# EAGLE design MIDImike (EAGLE 9.6.2)
REV: 0.1
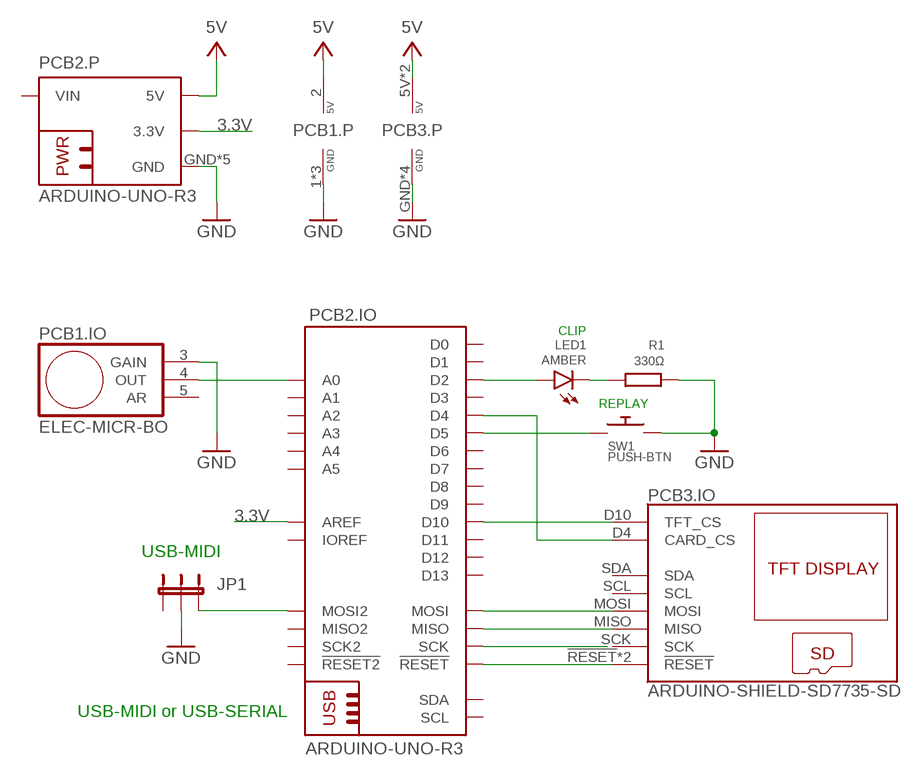
[diagram p0: schematic, sheet 1]

## Parts
JP1  JP2E  [JP2]
LED1  AMBER  LEDCHIPLED_0805  [CHIPLED_0805]
PCB1  ELEC-MICR-BO  [ELEC_MICR_BREAKOUT]
PCB2  ARDUINO-UNO-R3  [ARDUINO-UNO--R3]
PCB3  ARDUINO-SHIELD-SD7735-SD  [ARDIONO-SHIELD]
R1  330Ω  R-EU_R0805  [R0805]
SW1  PUSH-BTN  [TE_1-1825910-4]

## Nets
3.3V: PCB2.3.3V(.P:3.3V) PCB2.AREF(.IO:AREF)
5V: PCB1.2(.P:5V) PCB2.5V(.P:5V) PCB2.5V@1(.P:5V) PCB2.5V@2(.P:5V) PCB3.5V(.P:5V) PCB3.5V@1(.P:5V)
A0: PCB1.4(.IO:OUT) PCB2.A0(.IO:A0)
GND: JP1.2 PCB1.1(.P:GND) PCB1.3(.IO:GAIN) PCB1.P$1(.P:GND) PCB1.P$2(.P:GND) PCB2.GND(.P:GND) PCB2.GND@1(.P:GND) PCB2.GND@2(.P:GND) PCB2.GND@3(.P:GND) PCB2.GND@4(.P:GND) PCB3.GND(.P:GND) PCB3.GND@1(.P:GND) PCB3.GND@2(.P:GND) PCB3.GND@3(.P:GND) R1.1 SW1.2 SW1.2@1
N$1: LED1.A PCB2.D2(.IO:D2)
N$2: PCB2.MOSI(.IO:MOSI) PCB3.MOSI(.IO:MOSI)
N$3: JP1.3 PCB2.MOSI2(.IO:MOSI2)
N$4: PCB2.D10(.IO:D10) PCB3.D10(.IO:TFT_CS)
N$5: PCB2.MISO(.IO:MISO) PCB3.MISO(.IO:MISO)
N$6: PCB2.SCK(.IO:SCK)
N$7: PCB2.!RESET!(.IO:!RESET!) PCB2.!RESET!@1(.IO:!RESET!) PCB3.!RESET!(.IO:!RESET!) PCB3.!RESET!@1(.IO:!RESET!)
N$8: LED1.C R1.2
N$9: PCB2.D4(.IO:D4) PCB3.D4(.IO:CARD_CS)
REPLAY: PCB2.D5(.IO:D5) SW1.1 SW1.1@1
Unconnected: JP1.1 PCB1.5(.IO:AR) PCB2.!RESET2!(.IO:!RESET2!) PCB2.A1(.IO:A1) PCB2.A2(.IO:A2) PCB2.A3(.IO:A3) PCB2.A4(.IO:A4) PCB2.A5(.IO:A5) PCB2.D0(.IO:D0) PCB2.D1(.IO:D1) PCB2.D3(.IO:D3) PCB2.D6(.IO:D6) PCB2.D7(.IO:D7) PCB2.D8(.IO:D8) PCB2.D9(.IO:D9) PCB2.D11(.IO:D11) PCB2.D12(.IO:D12) PCB2.D13(.IO:D13) PCB2.IOREF(.IO:IOREF) PCB2.MISO2(.IO:MISO2) PCB2.SCK2(.IO:SCK2) PCB2.SCL(.IO:SCL) PCB2.SDA(.IO:SDA) PCB2.VIN(.P:VIN) PCB3.SCK(.IO:SCK) PCB3.SCL(.IO:SCL) PCB3.SDA(.IO:SDA)

## Notes on the sheet
- CLIP
- REPLAY
- USB-MIDI
- USB-MIDI or USB-SERIAL

## Library data of the parts
JP1 = Coert-Vonk:JP2E: JUMPER
LED1 = OPNpool:LED: LED OSRAM: - CHIPLED LG R971, LG N971, LY N971, LG Q971, LY Q971, LO R971, LY R971 LH N974, LH R974 LS Q976, LO Q976, LY Q976 LO Q996 - Hyper CHIPLED LW Q18S LB Q993, LB Q99A, LB R99A - SideLED LS A670, LO A670, LY A670, LG A670, LP A670 LB A673, LV A673, LT A673, LW A673 LH A674 LY A675 LS A676, LA A676, LO A676, LY A676, LW A676 LS A679, LY A679, LG A679 - Hyper Micro SIDELED® LS Y876, LA Y876, LO Y876, LY Y876 LT Y87S - SmartLED LW L88C, LW L88S LB L89C, LB L89S, LG L890 LS L89K, LO L89K, LY L89K LS L896, LA L896, LO L896, LY L896 - TOPLED LS T670, LO T670, LY T670, LG T670, LP T670 LSG T670, LSP T670, LSY T670, LOP T670, LYG T670 LG T671, LOG T671, LSG T671 LB T673, LV T673, LT T673, LW T673 LH T674 LS T676, LA T676, LO T676, LY T676, LB T676, LH T676, LSB T676, LW T676 LB T67C, LV T67C, LT T67C, LS T67K, LO T67K, LY T67K, LW E67C LS E67B, LA E67B, LO E67B, LY E67B, LB E67C, LV E67C, LT E67C LW T67C LS T679, LY T679, LG T679 LS T770, LO T770, LY T770, LG T770, LP T770 LB T773, LV T773, LT T773, LW T773 LH T774 LS E675, LA E675, LY E675, LS T675 LS T776, LA T776, LO T776, LY T776, LB T776 LHGB T686 LT T68C, LB T68C - Hyper Mini TOPLED® LB M676 - Mini TOPLED Santana® LG M470 LS M47K, LO M47K, LY M47K Source: http://www.osram.convergy.de LUXEON: - LUMILED® LXK2-PW12-R00, LXK2-PW12-S00, LXK2-PW14-U00, LXK2-PW14-V00 LXK2-PM12-R00, LXK2-PM12-S00, LXK2-PM14-U00 LXK2-PE12-Q00, LXK2-PE12-R00, LXK2-PE12-S00, LXK2-PE14-T00, LXK2-PE14-U00 LXK2-PB12-K00, LXK2-PB12-L00, LXK2-PB12-M00, LXK2-PB14-N00, LXK2-PB14-P00, LXK2-PB14-Q00 LXK2-PR12-L00, LXK2-PR12-M00, LXK2-PR14-Q00, LXK2-PR14-R00 LXK2-PD12-Q00, LXK2-PD12-R00, LXK2-PD12-S00 LXK2-PH12-R00, LXK2-PH12-S00 LXK2-PL12-P00, LXK2-PL12-Q00, LXK2-PL12-R00 Source: www.luxeon.com KINGBRIGHT: KA-3528ASYC Source: www.kingbright.com
PCB1 = Coert-Vonk:ELEC-MICR-BO: Footprint of Adafruit AGC Electret Microphone Amplifier - MAX9814 Link to part <https://learn.adafruit.com/adafruit-agc-electret-microphone-amplifier-max9814/overview>
PCB2 = Coert-Vonk:ARDUINO-UNO-R3: Footprint of Arduino R3 with two SPI headers Arduino Uno R3 Compatible Footprint. Matches PCB size of the original board.
PCB3 = Coert-Vonk:ARDUINO-SHIELD-SD7735-SD: Footprint of 1.8" Color TFT LCD display with MicroSD Card Shield - ST7735Rr Link to part <https://learn.adafruit.com/1-8-tft-display/1-8-tft-shield>
R1 = rcl:R-EU_: RESISTOR, European symbol; MANF: Bourns; MANF#: CRM0805-JW-1R5ELF; MOUSER#: 652-CRM0805JW1R5ELF; SPICEPREFIX: R
SW1 = Coert-Vonk:PUSH-BTN: Switch Tactile OFF (ON) SPST Round Button PC Pins 0.05A 24VDC 100000Cycles 1.56N Thru-Hole Loose; COMMENT: 1-1825910-4; DESCRIPTION: Switch Tactile OFF (ON) SPST Round Button PC Pins 0.05A 24VDC 100000Cycles 1.56N Thru-Hole; DIGI-KEY_PART_NUMBER: 450-1653-ND; MF: TE Connectivity; MP: 1-1825910-4; PACKAGE: None; PURCHASE-URL: https://pricing.snapeda.com/search/part/1-1825910-4/?ref=eda

## Board
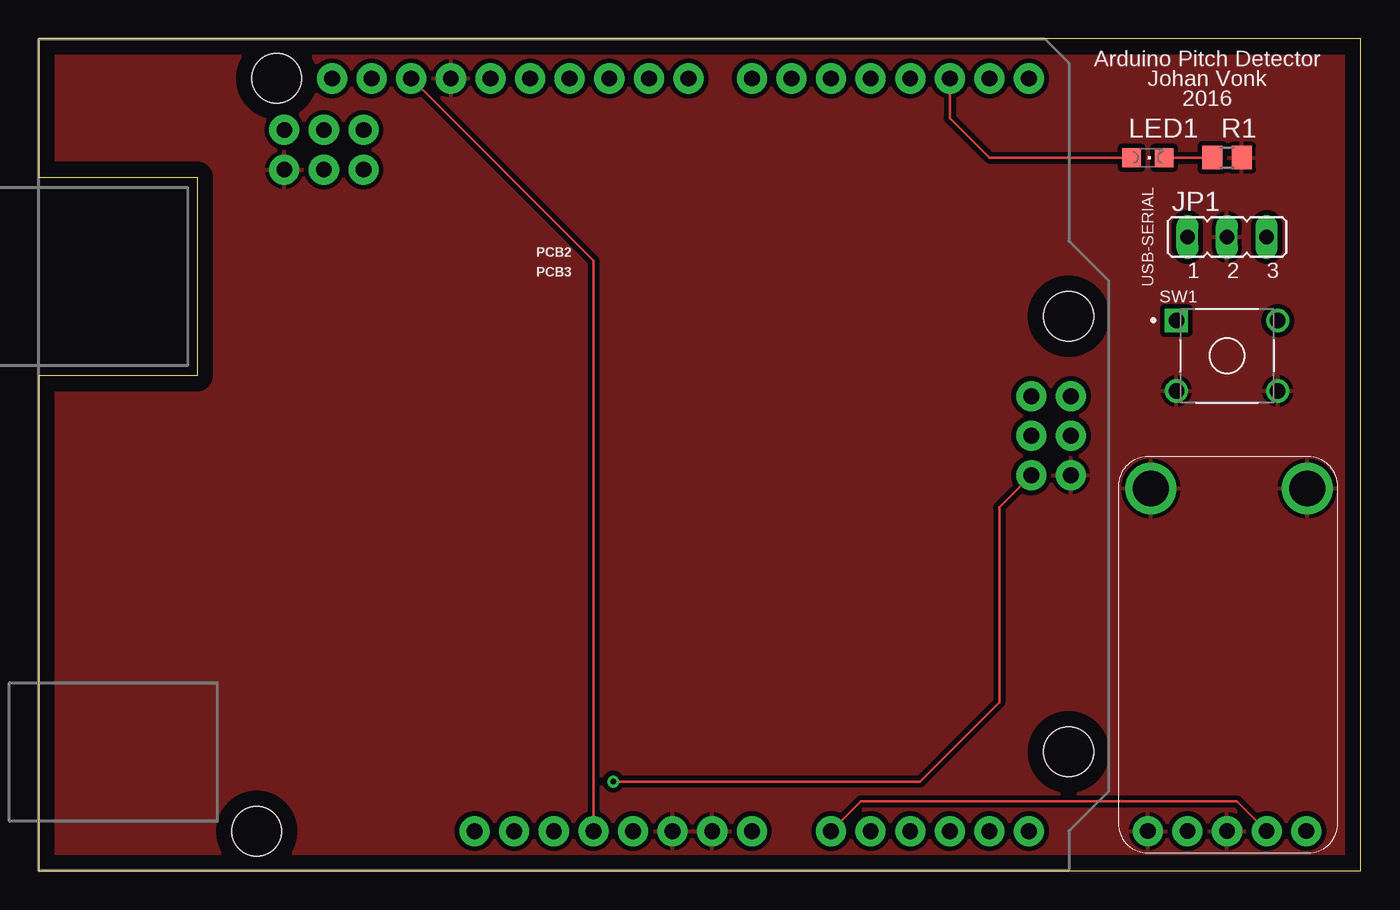
[diagram p1: board, top side]
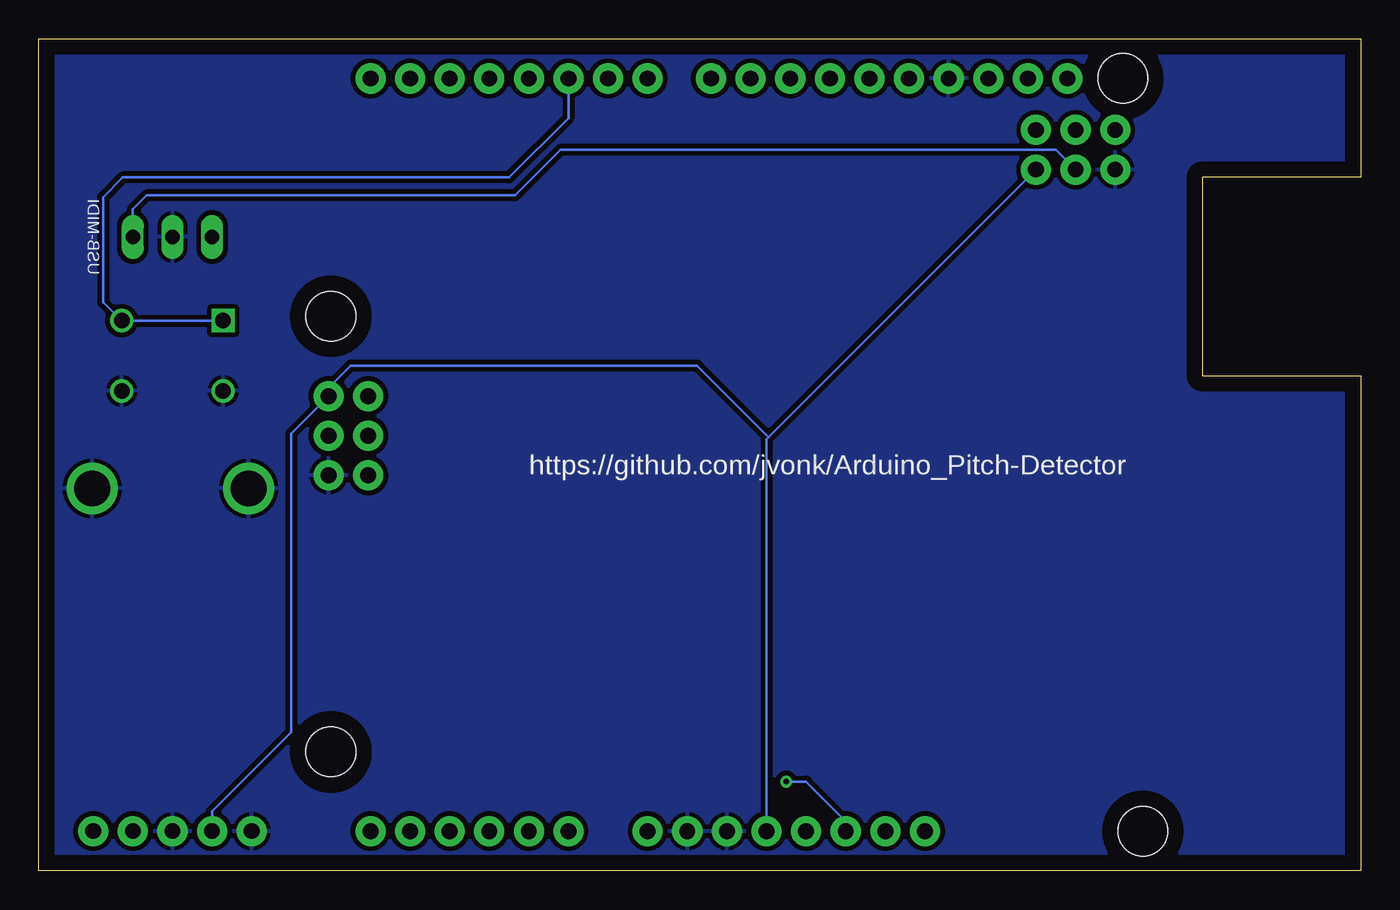
[diagram p2: board, bottom side, seen from below]

Size 84.76 x 53.33 mm. Coordinates in mm from the lower left corner, seen from the top.
Outline: 0,0 84.76,0 84.76,53.33 0,53.33 0,44.45 10.16,44.45 10.16,31.75 0,31.75 0,0
Copper layers (1*16): Top 0.035mm / dielectric 1.5mm / Bottom 0.035mm
Design rules "default": minimum track width 6mil, minimum drill 0.35mm, track to track 6mil, track to pad 6mil, pad to pad 6mil, via to via 6mil, smd to smd 6mil, copper to edge 40mil, drill to drill 6mil, minimum pad ring 10mil, minimum via ring 8mil, stop-mask expansion 4mil, vias tented up to drill 0mil, thermal gap 10mil

### Footprints (pad centres in the part's own frame; a part is rotated, then mirrored left to right if it is on the bottom)
JP2 = drill 0.914 long: 1 -2.54,0; 2 0,0; 3 2.54,0
CHIPLED_0805 = smd 1.2 x 1.2: A 0,-1.05; C 0,1.05
ELEC_MICR_BREAKOUT = drill 1 pad 1.93: 1 -11.303,5.715; 2 -11.303,3.175; 3 -11.303,0.635; 4 -11.303,-1.905; 5 -11.303,-4.445 | drill 2.28: P$1 10.668,5.524; P$2 10.668,-4.508
ARDUINO-UNO--R3 = drill 1.016 pad 1.93: 3.3V 2.54,-24.13; 5V 5.08,-24.13; 5V@1 33.16,3.76; 5V@2 -12.204,18.289; !RESET2! -17.284,20.829; !RESET! 0,-24.13; !RESET!@1 30.62,-1.32; A0 17.78,-24.13; A1 20.32,-24.13; A2 22.86,-24.13; A3 25.4,-24.13; A4 27.94,-24.13; A5 30.48,-24.13; AREF -9.144,24.13; D0 30.48,24.13; D1 27.94,24.13; D2 25.4,24.13; D3 22.86,24.13; D4 20.32,24.13; D5 17.78,24.13; D6 15.24,24.13; D7 12.7,24.13; D8 8.636,24.13; D9 6.096,24.13; D10 3.556,24.13; D11 1.016,24.13; D12 -1.524,24.13; D13 -4.064,24.13; GND 7.62,-24.13; GND@1 10.16,-24.13; GND@2 -6.604,24.13; GND@3 33.16,-1.32; GND@4 -17.284,18.289; IOREF -2.54,-24.13; MISO 30.62,3.76; MISO2 -12.204,20.829; MOSI 33.16,1.22; MOSI2 -14.744,18.289; NC -5.08,-24.13; SCK 30.62,1.22; SCK2 -14.744,20.829; SCL -14.224,24.13; SDA -11.684,24.13; VIN 12.7,-24.13 | hole 3.175: -17.78,24.13; 33.02,8.89; 33.02,-19.05; -19.05,-24.13
ARDIONO-SHIELD = drill 1.016 pad 1.93: 3.3V 2.54,-22.86; 5V 5.08,-22.86; 5V@1 33.16,5.03; !RESET! 0,-22.86; !RESET!@1 30.62,-0.05; A0 17.78,-22.86; A1 20.32,-22.86; A2 22.86,-22.86; A3 25.4,-22.86; A4 27.94,-22.86; A5 30.48,-22.86; AREF -9.144,25.4; D0 30.48,25.4; D1 27.94,25.4; D2 25.4,25.4; D3 22.86,25.4; D4 20.32,25.4; D5 17.78,25.4; D6 15.24,25.4; D7 12.7,25.4; D8 8.636,25.4; D9 6.096,25.4; D10 3.556,25.4; D11 1.016,25.4; D12 -1.524,25.4; D13 -4.064,25.4; GND 7.62,-22.86; GND@1 10.16,-22.86; GND@2 -6.604,25.4; GND@3 33.16,-0.05; IOREF -2.54,-22.86; MISO 30.62,5.03; MOSI 33.16,2.49; NC -5.08,-22.86; SCK 30.62,2.49; SCL -14.224,25.4; SDA -11.684,25.4; VIN 12.7,-22.86 | hole 3.175: -17.78,25.4; 33.02,10.16; 33.02,-17.78; -19.05,-22.86
R0805 = smd 1.3 x 1.5: 1 -0.95,0; 2 0.95,0
TE_1-1825910-4 = drill 0.99 square: 1 -3.25,2.25 | drill 0.99: 1@1 3.25,2.25; 2 -3.25,-2.25; 2@1 3.25,-2.25

### Placement (x,y rotation side)
JP1  76.2,40.64 0 top
LED1  71.12,45.72 270 top
PCB1  76.83,13.84 90 top
PCB2  33.02,26.67 0 top
PCB3  33.02,25.4 0 top
R1  76.2,45.72 180 top
SW1  76.2,33.02 0 top

### Tracks (layer width: path | path; a pad name or v marks a point on that pad's centre or on a via)
3.3V
  Top 0.152: PCB2.AREF 35.56,39.12 PCB2.3.3V
5V
  Bottom 0.152: PCB1.2 73.66,3.81 68.58,8.89 68.58,28.03 PCB3.5V@1 66.18,30.98 64.77,32.38 42.55,32.38 37.97,27.81 | PCB2.5V@2 37.97,27.81 | 37.97,27.81 38.1,27.67 PCB3.5V
A0
  Top 0.152: PCB1.4 76.83,4.45 52.7,4.45 PCB2.A0
GND
  pour Bottom (isolate 0.305): 0,44.45 0,53.34 84.71,53.34 84.71,0 0,0 0,31.75 10.16,31.75 10.16,44.45
  pour Top (isolate 0.305): 0,44.45 0,53.34 84.71,53.34 84.71,0 0,0 0,31.75 10.16,31.75 10.16,44.45
N$1
  Top 0.152: PCB2.D2 58.42,48.26 60.96,45.72 LED1.A
N$3
  Bottom 0.152: PCB2.MOSI2 19.55,46.23 51.31,46.23 54.23,43.31 77.85,43.31 78.74,42.42 JP1.3
N$7  (via drill 0.35)
  Top 0.152: PCB2.!RESET!@1 61.59,23.3 61.59,10.79 56.52,5.71 v36.83,5.71 | 33.07,2.59 PCB2.!RESET!
  Bottom 0.152: 33.06,3.21 35.56,5.71 v36.83,5.71 | 33.06,3.21 33.02,3.17 | PCB2.!RESET! 33.07,2.59 33.07,3.2 33.06,3.21
N$8
  Top 0.152: LED1.C R1.2
REPLAY
  Bottom 0.152: PCB2.D5 50.8,48.26 54.61,44.45 79.38,44.45 80.64,43.18 80.64,36.47 SW1.1@1 SW1.1

### Text on the board
tPlace: Arduino Pitch Detector | Johan Vonk | 2016 | USB-SERIAL
bPlace: USB-MIDI | https://github.com/jvonk/Arduino_Pitch-Detector